# Altium project buck-MT2492.PrjPcb
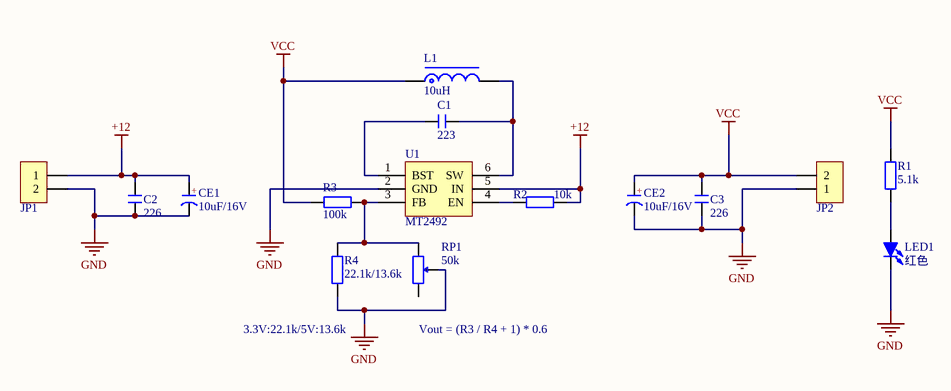
[diagram p0: Sheet1.SchDoc]
1 sheet, 15 parts. Net scope: global (net labels, ports and power ports of the same name join across sheets).
Board file: PCB1.PcbDoc

## Sheet Sheet1.SchDoc
size A4; SheetNumber: 1; SheetTotal: 1

### Parts
C1  223  [C 0805-M]
C2  226  [C 0805-M]
C3  226  [C 0805-M]
CE1  10uF/16V  [CAP 1.5*4*8]
CE2  10uF/16V  [CAP 1.5*4*8]
JP1  HDR-1X2  [KF2EDGK5.0-LI-2P]  (value not drawn)
JP2  HDR-1X2  [KF2EDGK5.0-LI-2P]  (value not drawn)
L1  10uH  [L-SMD-0630]
LED1  红色  [LED 0805G]
R1  5.1k  [R 0805_L]
R2  10k  [R 0805_L]
R3  100k  [R 0805_L]
R4  22.1k/13.6k  [R 0805_L]
RP1  50k  [3303W]
U1  MT2492  [SOT23-6N]

### Nets
+12: C2.2 CE1.1(A) JP1.1 R2.2 U1.5(IN)
GND: C2.1 C3.1 CE1.2(K) CE2.2(K) JP1.2 JP2.1 LED1.2(K) R4.1 RP1.2 U1.2(GND)
VCC: C3.2 CE2.1(A) JP2.2 L1.1 R1.2 R3.1
NetC1_1: C1.1 L1.2 U1.6(SW)
NetC1_2: C1.2 U1.1(BST)
NetLED1_1: LED1.1(A) R1.1
NetR2_1: R2.1 U1.4(EN)
NetR3_2: R3.2 R4.2 RP1.1 U1.3(FB)

Not connected (* = marked no-connect by the designer): RP1 3

### Notes on the sheet
- (near R4) 3.3V:22.1k/5V:13.6k
- (near RP1) Vout = (R3 / R4 + 1) * 0.6
- (in symbol CE) +

### Library data of the parts
C1-C3 = C: 贴片电容; BOM名称: 无极性贴片电容; 优秀评价可免费更新: 联系淘宝ID：黄晶宝石，获取更新版封装库; 本封装库来自淘宝卖家 ID：黄晶宝石: 其他店铺购入均为盗版，请立即申请退款; 联系卖家，免费查找封装: 唯一出售店铺网址https://shop463601444.taobao.com
CE1 CE2 = CE: 直插电解电容; 优秀评价可免费更新: 联系淘宝ID：黄晶宝石，获取更新版封装库; 本封装库来自淘宝卖家 ID：黄晶宝石: 其他店铺购入均为盗版，请立即申请退款; 联系卖家，免费查找封装: 唯一出售店铺网址https://shop463601444.taobao.com; BOM名称: 直插电解电容
JP1 JP2 = Header 2: 2P接插件; 版权归属: 封装库来自淘宝 ID：黄晶宝石; 优秀评价可免费更新封装库: 联系淘宝ID：黄晶宝石，获取更新版封装库; 卖家免费技术支持，联系售后: 唯一出售店铺网址https://shop463601444.taobao.com; 封装库来自淘宝卖家 ID：黄晶宝石: 其他店铺购入均为盗版，请立即申请退款; BOM名称: 2P接插件
L1 = L-NR: NR磁胶电感; 优秀评价可免费更新: 联系淘宝ID：黄晶宝石，获取更新版封装库; 本封装库来自淘宝卖家 ID：黄晶宝石: 其他店铺购入均为盗版，请立即申请退款; 联系卖家，免费查找封装: 唯一出售店铺网址https://shop463601444.taobao.com; BOM名称: NR磁胶电感
LED1 = LED-SMD: 贴片LED; 封装库来自淘宝卖家 ID：黄晶宝石: 其他店铺购入均为假冒，请立即申请退款，本店奖励2~5元现金; 卖家免费查找封装，联系售后: 唯一出售店铺网址https://shop463601444.taobao.com; BOM名称: 贴片LED
R1-R4 = R: 贴片电阻; 优秀评价可免费更新: 联系淘宝ID：黄晶宝石，获取更新版封装库; 本封装库来自淘宝卖家 ID：黄晶宝石: 其他店铺购入均为盗版，请立即申请退款; 联系卖家，免费查找封装: 唯一出售店铺网址https://shop463601444.taobao.com; BOM名称: 贴片电阻
RP1 = RP-SMD: 贴片电位器; 优秀评价可免费更新: 联系淘宝ID：黄晶宝石，获取更新版封装库; 本封装库来自淘宝卖家 ID：黄晶宝石: 其他店铺购入均为盗版，请立即申请退款; 联系卖家，免费查找封装: 唯一出售店铺网址https://shop463601444.taobao.com; BOM名称: 贴片电位器
U1 = MP2359: DC降压芯片; 卖家免费技术支持，联系售后: 唯一出售店铺网址https://shop463601444.taobao.com; 封装库来自淘宝卖家 ID：黄晶宝石: 其他店铺购入均为假冒，请立即申请退款，本店奖励2~5元现金; BOM名称: DC降压芯片; 卖家免费查找封装，联系售后: 唯一出售店铺网址https://shop463601444.taobao.com